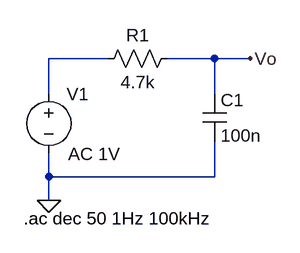
[diagram p0: schematic E4-FPB-RC.asc]
E4-FPB-RC.asc, the LTspice schematic file:
Version 4
SHEET 1 880 680
WIRE -240 -160 -320 -160
WIRE -96 -160 -160 -160
WIRE -48 -160 -96 -160
WIRE -320 -112 -320 -160
WIRE -96 -112 -96 -160
WIRE -320 0 -320 -32
WIRE -96 0 -96 -48
WIRE -96 0 -320 0
WIRE -320 32 -320 0
FLAG -320 32 0
FLAG -48 -160 Vo
SYMBOL voltage -320 -128 R0
WINDOW 123 26 97 Left 2
WINDOW 39 0 0 Left 0
SYMATTR InstName V1
SYMATTR Value ""
SYMATTR Value2 AC 1V
SYMBOL res -144 -176 R90
WINDOW 0 0 56 VBottom 2
WINDOW 3 32 56 VTop 2
SYMATTR InstName R1
SYMATTR Value 4.7k
SYMBOL cap -112 -112 R0
SYMATTR InstName C1
SYMATTR Value 100n
TEXT -354 56 Left 2 !.ac dec 50 1Hz 100kHz

The netlist it stands for:
* E4-FPB-RC.asc
V1 N001 0 AC 1V
R1 Vo N001 4.7k
C1 Vo 0 100n
.ac dec 50 1Hz 100kHz
.backanno
.end